# Altium project Grounded clock.PrjPcb (part 2 of 2)

## Sheet Power supply.SchDoc
size A; DrawnBy: James WIlson; Revision: B
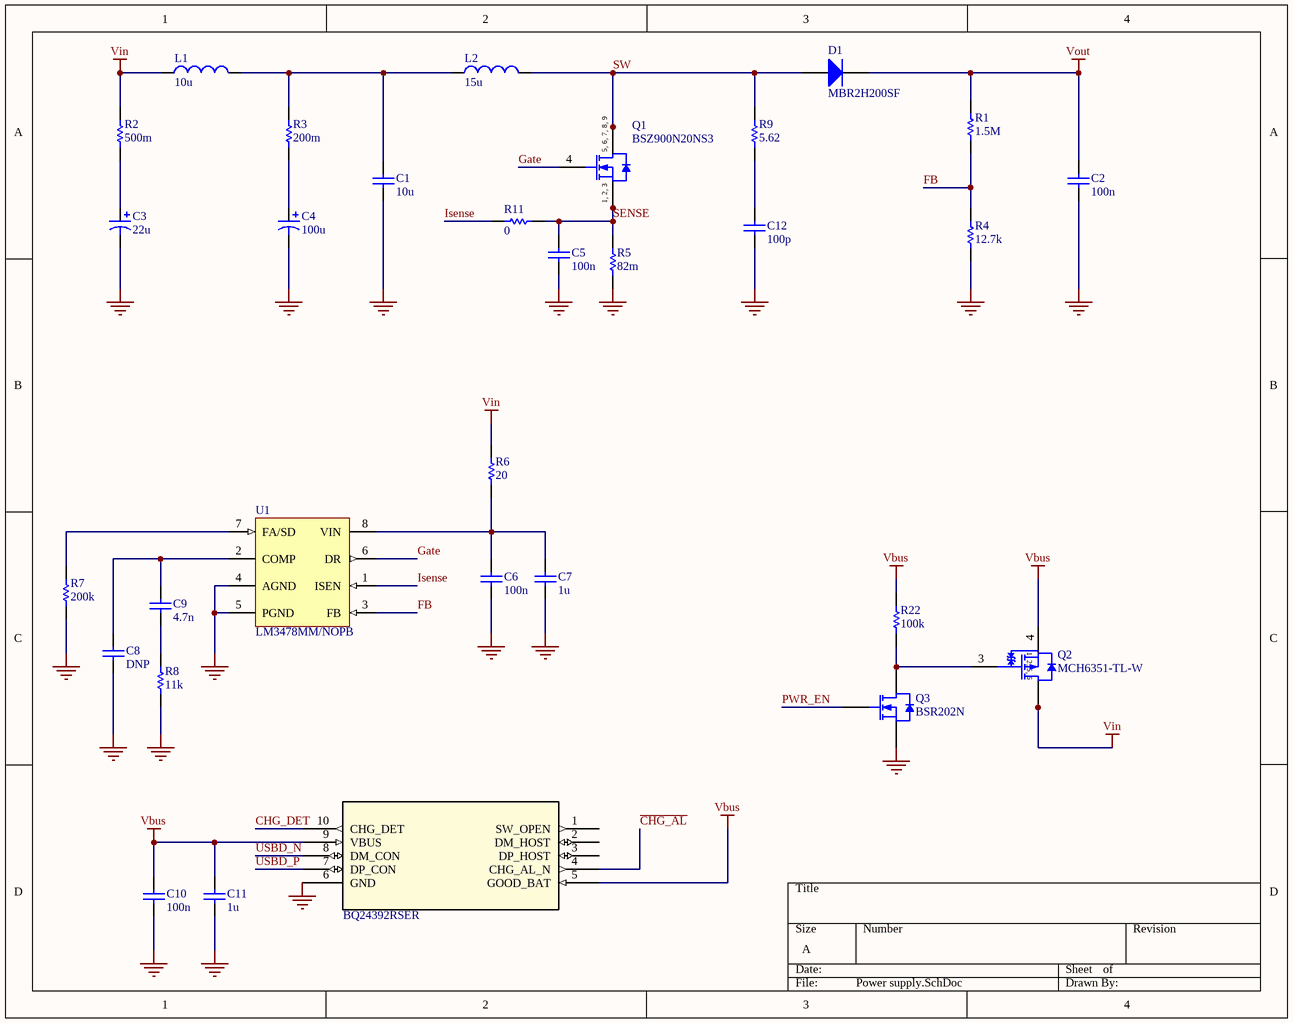
[diagram p3: Power supply.SchDoc]

### Parts
C1  10u  [CAPC1206(3216)190_N]
C2  100n  [CAPC1812(4532)230_N]
C3  22u  [KEMET A]
C4  100u  [KEMET A]
C5  100n  [CAPC0603(1608)100_N]
C6  100n  [CAPC0402(1005)33_N]
C7  1u  [CAPC0402(1005)33_N]
C8  DNP  [CAPC0603(1608)100_N]  (no BOM)
C9  4.7n  [CAPC0603(1608)100_N]
C10  100n  [CAPC0402(1005)33_N]
C11  1u  [CAPC0402(1005)33_N]
C12  100p  [CAPC0603(1608)100_N]
D1  MBR2H200SF  [SOD-123FL]
L1  10u  [VLS6045EX]
L2  15u  [SRU8043]
Q1  BSZ900N20NS3  [PG-TSDSON-8]
Q2  MCH6351-TL-W  [SOT23-6P65_210X90L25X32]
Q3  BSR202N  [INF-PG-SC59_N]
R1  1.5M  [RESC0805(2012)_N]
R2  500m  [RESC0402(1005)_N]
R3  200m  [RESC0402(1005)_N]
R4  12.7k  [RESC0805(2012)_N]
R5  82m  [RESC0603(1608)_N]
R6  20  [RESC0402(1005)_N]
R7  200k  [RESC0402(1005)_N]
R8  11k  [RESC0402(1005)_N]
R9  5.62  [RESC0603(1608)_N]
R11  0  [RESC0402(1005)_N]
R22  100k  [RESC0402(1005)_N]
U1  LM3478MM/NOPB  [DGK0008A_N]
U2  BQ24392RSER  [QFN50P200X150X60-10N]

### Nets
GND: C1.1 C2.1 C3.2 C4.2 C5.1 C6.1 C7.1 C8.1 C10.1 C11.1 C12.1 Q3.2(SOURCE) R4.1 R5.1 R7.1 R8.1 U1.4(AGND) U1.5(PGND) U2.6(GND)
Vbus: C10.2 C11.2 Q2.4(S) R22.2 U2.5(GOOD_BAT) U2.9(VBUS)
Vin: L1.1 Q2.1(D) Q2.2(D) Q2.5(D) Q2.6(D) R2.2 R6.2
Vout: C2.2 D1.2(K) R1.2
~{CHG_AL}: U2.4(CHG_AL_N)
CHG_DET: U2.10(CHG_DET)
FB: R1.1 R4.2 U1.3(FB)
Gate: Q1.4(GATE) U1.6(DR)
Isense: R11.1 U1.1(ISEN)
PWR_EN: Q3.1(GATE)
SENSE: C5.2 Q1.1(SOURCE) Q1.2(SOURCE) Q1.3(SOURCE) R5.2 R11.2
SW: D1.1(A) L2.2 Q1.5(DRAIN) Q1.6(DRAIN) Q1.7(DRAIN) Q1.8(DRAIN) Q1.9(DRAIN) R9.2
USBD_N: U2.8(DM_CON)
USBD_P: U2.7(DP_CON)
NetC1_2: C1.2 L1.2 L2.1 R3.2
NetC3_1: C3.1 R2.1
NetC4_1: C4.1 R3.1
NetC6_2: C6.2 C7.2 R6.1 U1.8(VIN)
NetC8_2: C8.2 C9.2 U1.2(COMP)
NetC9_1: C9.1 R8.2
NetC12_2: C12.2 R9.1
NetQ2_3: Q2.3(G) Q3.3(DRAIN) R22.1
NetR7_2: R7.2 U1.7(FA/SD)

Not connected (* = marked no-connect by the designer): U2 1(SW_OPEN) 2(DM_HOST) 3(DP_HOST)

### Notes on the sheet
- (in symbol BSZ900N20NS3GATMA1) 5, 6, 7, 8, 9; 1, 2, 3
- (in symbol MCH6351-TL-W) 1, 2, 5, 6

### Library data of the parts
C1 = C3216X7R1E106K160AB: CAP CER 10UF 25V X7R 1206; Manufacturer: TDK Corporation; Tolerance: ±10%; Notification: Current market demand for these product types have resulted in fluctuating and extending lead times. Lead times may differ.; Supplier 1: Digi-Key; Manufacturer Part Number: C3216X7R1E106K160AB; RoHS: RoHS Compliant; Category: Capacitors; Stock 1: 20000; Pricing 1: 1=0.83, 10=0.589, 100=0.3881, 500=0.2875, 1000=0.24438 (USD); Packaging: Cut Tape (CT); Part Status: Active; Voltage - Rated: 25V; Temperature Coefficient: X7R; Operating Temperature: -55°C ~ 125°C; Features: Low ESL; Ratings: -; Applications: General Purpose; Failure Rate: -; Mounting Type: Surface Mount, MLCC; Package / Case: 1206 (3216 Metric); Size / Dimension: 0.126" L x 0.063" W (3.20mm x 1.60mm); Height - Seated (Max): -; Thickness (Max): 0.075" (1.90mm); Lead Spacing: -; Lead Style: -; ComponentLink1URL: https://product.tdk.com/info/en/catalog/datasheets/mlcc_commercial_general_en.pdf; ComponentLink1Description: https://product.tdk.com/info/en/catalog/datasheets/mlcc_commercial_general_en.pdf; Supplier Part Number 1: 445-7705-1-ND; Supplier 2: Mouser; Supplier Part Number 2: 810-C3216X7R1E106K
C2 = C1812C104J2GACAUTO: KEMET         C1812C104J2GACAUTO            SMD Multilayer Ceramic Capacitor, AEC-Q200 C Series, 0.1 F,  5%, C0G / NP0, 200 V; Capacitance: 100nF; Voltage Rating: 200V; Temperature Coefficient: 30ppm/°C; Supplier 1: Digi-Key; Manufacturer: KEMET; Manufacturer Part Number: C1812C104J2GACAUTO; Stock 1: 5000; Pricing 1: 1=2.08, 10=1.679, 100=1.2824 (USD); Mount: Surface Mount; Case/Package: 1812; Weight: 0.000952oz; Case Code (Metric): 4532; Case Code (Imperial): 1812; Dielectric Material: Ceramic; Min Operating Temperature: -55°C; Max Operating Temperature: 125°C; Tolerance: 5%; Packaging: Tape and Reel; Dielectric: C0G; Voltage: 200V; Termination: SMD/SMT; Voltage Rating (DC): 200V; Package Quantity: 500; Length: 4.5mm; Height: 2mm; Width: 3.2mm; Thickness: 0.087inch; Depth: 3.2mm; Ratings: AEC-Q200; REACH SVHC: No SVHC; Lead Free: Lead Free; ComponentLink1URL: http://www.farnell.com/datasheets/1929048.pdf; ComponentLink1Description: http://www.farnell.com/datasheets/1929048.pdf; Supplier Part Number 1: 399-11585-1-ND
C3 = T520A226M006ATE100: CAP TANT POLY 22UF 6.3V 1206; Supplier 1: Digi-Key; Supplier 2: Mouser; Supplier Part Number 1: 399-5271-1-ND; Supplier Part Number 2: 80-T520A226M6ATE100
C4 = T520A107M006ATE045: POLY TA SMD 3216 100UF 6.3V 20%; Supplier 1: Digi-Key; Supplier 2: Mouser; Supplier Part Number 1: 399-18160-1-ND; Supplier Part Number 2: 80-T520A107M06ATE045
C5 = C0603C104K8RACTU: CAP CER 0.1UF 10V X7R 0603; Manufacturer: KEMET; Dielectric Material: Ceramic; Capacitance: 100nF; Tolerance: 10%; Dissipation Factor: 5%; Supplier 1: Digi-Key; Manufacturer Part Number: C0603C104K8RACTU; Stock 1: 40000; Pricing 1: 1=0.16, 10=0.112, 100=0.0525, 500=0.03682, 1000=0.03049 (USD); Mount: PCB,Surface Mount; Case/Package: 0603; Number of Pins: 2; Case Code (Imperial): 0603; Case Code (Metric): 1608; Contact Plating: Matte,Tin; Min Operating Temperature: -55°C; Max Operating Temperature: 125°C; Voltage Rating: 10V; Packaging: Tape and Reel; Package Quantity: 1; Voltage Rating (DC): 10V; Dielectric: X7R; Termination: SMD/SMT; Voltage: 10V; Length: 1.6mm; Height: 0.8mm; Width: 0.8mm; Lead Pitch: 0.7mm; Thickness: 0.034inch; Depth: 0.8mm; Radiation Hardening: No; REACH SVHC: No SVHC; ComponentLink1URL: http://www.farnell.com/datasheets/2315110.pdf; ComponentLink1Description: http://www.farnell.com/datasheets/2315110.pdf; ComponentLink2URL: http://www.kemet.com/kemet/web/homepage/kechome.nsf/vapubfiles/KEM_C1002_X7R_SMD.pdf/$file/KEM_C1002_X7R_SMD.pdf; ComponentLink2Description: http://www.kemet.com/kemet/web/homepage/kechome.nsf/vapubfiles/KEM_C1002_X7R_SMD.pdf/$file/KEM_C1002_X7R_SMD.pdf; ComponentLink3URL: https://www.verical.com/server-webapp/html/getDatasheet?partID=91529; ComponentLink3Description: https://www.verical.com/server-webapp/html/getDatasheet?partID=91529; ComponentLink4URL: http://www.mouser.com/ds/2/212/KEM_C1002_X7R_SMD-1102033.pdf; ComponentLink4Description: http://www.mouser.com/ds/2/212/KEM_C1002_X7R_SMD-1102033.pdf; ComponentLink5URL: http://www.alliedelec.com/m/d/9bfe7773041ffe9d406e68bc7b377fdd.pdf; ComponentLink5Description: http://www.alliedelec.com/m/d/9bfe7773041ffe9d406e68bc7b377fdd.pdf; ComponentLink6URL: http://www.farnell.com/datasheets/1851736.pdf; ComponentLink6Description: http://www.farnell.com/datasheets/1851736.pdf; Supplier Part Number 1: 399-1095-1-ND
C6 C10 = CC0402KRX7R8BB104: CAP CER 0.1UF 25V X7R 0402; Manufacturer: Yageo; Tolerance: ±10%; Notification: Current market demand for these product types have resulted in fluctuating and extending lead times. Lead times may differ.; Supplier 1: Digi-Key; Manufacturer Part Number: CC0402KRX7R8BB104; RoHS: RoHS Compliant; Category: Capacitors; Stock 1: 0; Pricing 1: 1=0.1, 10=0.048, 100=0.0215, 500=0.01534, 1000=0.01205, 2500=0.01095, 5000=0.01007 (USD); Packaging: Cut Tape (CT); Part Status: Active; Voltage - Rated: 25V; Temperature Coefficient: X7R; Operating Temperature: -55°C ~ 125°C; Features: -; Ratings: -; Applications: General Purpose; Failure Rate: -; Mounting Type: Surface Mount, MLCC; Package / Case: 0402 (1005 Metric); Size / Dimension: 0.039" L x 0.020" W (1.00mm x 0.50mm); Height - Seated (Max): -; Thickness (Max): 0.022" (0.55mm); Lead Spacing: -; Lead Style: -; ComponentLink1URL: http://www.yageo.com/documents/recent/UPY-GPHC_X7R_6.3V-to-50V_18.pdf; ComponentLink1Description: http://www.yageo.com/documents/recent/UPY-GPHC_X7R_6.3V-to-50V_18.pdf; Supplier Part Number 1: 311-2077-1-ND; Supplier 2: Mouser; Supplier Part Number 2: 603-CC402KRX7R8BB104
C7 C11 = CGB2A1X5R1E105K033BC: CAP CER 1UF 25V X5R 0402; Supplier 1: Digi-Key; Supplier 2: Mouser; Supplier Part Number 1: 445-13185-1-ND; Supplier Part Number 2: 810-CGB2A1X5R1E105BC
C8 = 0402 DNP JUMPER
C9 = C1608C0G1H472J080AA: CAP CER 4700PF 50V C0G 0603; Supplier 1: Digi-Key; Supplier 2: Mouser; Supplier Part Number 1: 445-7400-1-ND; Supplier Part Number 2: 810-C1608C0G1H472J
C12 = C0603C101JAGACTU: CAP CER 100PF 250V C0G/NP0 0603; Manufacturer: KEMET; Dielectric Material: Ceramic; Tolerance: 5%; Supplier 1: Digi-Key; Manufacturer Part Number: C0603C101JAGACTU; Stock 1: 7181; Pricing 1: 1=0.56, 10=0.397, 100=0.2612, 500=0.1935, 1000=0.16448 (USD); Case/Package: 0603; Voltage Rating (DC): 250V; Capacitance: 100pF; Lead Free: Lead Free; Supplier 2: Mouser; Stock 2: 0; Pricing 2: 1=0.54, 10=0.313, 50=0.313, 100=0.189, 1000=0.155, 10000=0.135 (USD); Supplier Part Number 1: 399-14933-1-ND; Supplier Part Number 2: 80-C0603C101JAG
D1 = MBR2H200SF: DIODE SCHOTTKY 200V 2A SOD123; pin to pad: 1>A 2>K; Manufacturer: ON Semiconductor; Manufacturer Part Number: MBR2H200SFT3G; Supplier 1: Digi-Key; Supplier Part Number 1: MBR2H200SFT3GOSCT-ND; Stock 1: 78470; Pricing 1: 1=0.44, 10=0.328, 100=0.1857, 500=0.12298, 1000=0.09428 (USD); Mount: Surface Mount; Packaging: Tape and Reel; Average Rectified Current: 2A; Max Reverse Voltage (DC): 200V; Lead Free: Lead Free
L1 = VLS6045EX-100M: FIXED IND 10UH 3.4A 61 MOHM SMD; Supplier 1: Digi-Key; Supplier 2: Mouser; Supplier Part Number 1: 445-173039-1-ND; Supplier Part Number 2: 810-VLS6045EX-100M
L2 = SRU8043-150Y: FIXED IND 15UH 2.7A 46 MOHM SMD; Manufacturer: Bourns; Core Material: Ferrite; Tolerance: 30%; DC Resistance (DCR): 46mR; Saturation Current: 2A; Shielding: Shielded; Q Factor: 26; Self Resonant Frequency: 15MHz; Test Frequency: 100kHz; Supplier 1: Digi-Key; Manufacturer Part Number: SRU8043-150Y; Stock 1: 6452; Pricing 1: 1=0.97, 10=0.897, 100=0.6486, 500=0.4968 (USD); Mount: Surface Mount; Case/Package: Nonstandard; Min Operating Temperature: -40°C; Max Operating Temperature: 125°C; Inductance: 15uh; Max DC Current: 2.7A; Package Quantity: 1000; Current Rating: 2.7A; Packaging: Tape and Reel; Inductance Tolerance: 30%; Composition: Wirewound; Termination: SMD/SMT; RMS Current (Irms): 2.7A; DC Current: 2.7A; Military Standard: Not; Length: 8mm; Height: 4.3mm; Width: 0.315inch; Height - Seated (Max): 0.181inch; Depth: 8.3mm; REACH SVHC: No SVHC; ComponentLink1URL: http://www.bourns.com/docs/Product-Datasheets/SRU8043.pdf; ComponentLink1Description: http://www.bourns.com/docs/Product-Datasheets/SRU8043.pdf; ComponentLink2URL: http://www.farnell.com/datasheets/70887.pdf; ComponentLink2Description: http://www.farnell.com/datasheets/70887.pdf; ComponentLink3URL: http://www.mouser.com/ds/2/54/RU8043-778433.pdf; ComponentLink3Description: http://www.mouser.com/ds/2/54/RU8043-778433.pdf; ComponentLink4URL: http://www.farnell.com/datasheets/1776933.pdf; ComponentLink4Description: http://www.farnell.com/datasheets/1776933.pdf; ComponentLink5URL: http://uk.rs-online.com/webdocs/0dd1/0900766b80dd1166.pdf; ComponentLink5Description: http://uk.rs-online.com/webdocs/0dd1/0900766b80dd1166.pdf; ComponentLink6URL: http://www.bourns.com/pdfs/SRU8043.pdf; ComponentLink6Description: http://www.bourns.com/pdfs/SRU8043.pdf; Supplier Part Number 1: SRU8043-150YCT-ND
Q1 = BSZ900N20NS3GATMA1: Trans MOSFET N-CH 200V 15.2A 8-Pin TSDSON; Manufacturer: Infineon; Gate to Source Voltage (Vgs): 20V; Rise Time: 4ns; Turn-On Delay Time: 5ns; Turn-Off Delay Time: 10ns; Fall Time: 3ns; Power Dissipation: 62.5W; Number of Elements: 1; Supplier 1: Digi-Key; Manufacturer Part Number: BSZ900N20NS3GATMA1; Stock 1: 334; Pricing 1: 1=1.84, 10=1.665, 100=1.3378, 500=1.04054, 1000=0.86216 (USD); Mount: Surface Mount; Number of Pins: 8; Contact Plating: Tin; Min Operating Temperature: -55°C; Max Operating Temperature: 150°C; Continuous Drain Current (ID): 15.2A; Drain to Source Voltage (Vdss): 200V; Max Dual Supply Voltage: 200V; Lead Free: Contains Lead; Halogen Free: Halogen Free; ComponentLink1URL: http://www.infineon.com/dgdl/BSZ900N20NS3+Rev2.2.pdf?folderId=db3a304325305e6d012596c6ca7b290a&fileId=db3a30432ad629a6012b15f1be561a9b; ComponentLink1Description: http://www.infineon.com/dgdl/BSZ900N20NS3+Rev2.2.pdf?folderId=db3a304325305e6d012596c6ca7b290a&fileId=db3a30432ad629a6012b15f1be561a9b; Supplier Part Number 1: BSZ900N20NS3GATMA1CT-ND
Q2 = MCH6351-TL-W: MOSFET PCH 1.8V DRIVE SERIES; Manufacturer: ON Semiconductor; Rise Time: 89ns; Drain to Source Voltage (Vdss): 12V; Continuous Drain Current (ID): 9A; Rds On Max: 16.9mR; Input Capacitance: 2.2nF; Max Power Dissipation: 1.5W; Number of Channels: 1; Turn-On Delay Time: 12.3ns; Turn-Off Delay Time: 260ns; Fall Time: 122ns; Drain to Source Breakdown Voltage: -12V; Gate to Source Voltage (Vgs): 10V; Element Configuration: Single; ComponentLink2Description: http://www.mouser.com/ds/2/308/ENA2198-D-278502.pdf; ComponentLink1Description: http://www.onsemi.com/pub_link/Collateral/ENA2198-D.PDF; ComponentLink1URL: http://www.onsemi.com/pub_link/Collateral/ENA2198-D.PDF; ComponentLink2URL: http://www.mouser.com/ds/2/308/ENA2198-D-278502.pdf; Supplier 1: Digi-Key; Supplier Part Number 1: MCH6351-TL-WOSCT-ND; Manufacturer Part Number: MCH6351-TL-W; Stock 1: 2960; Pricing 1: 1=0.59, 10=0.499, 100=0.3739, 500=0.27418, 1000=0.21187 (USD); Case/Package: SMD/SMT; Number of Pins: 6; Weight: 0.000265oz; Min Operating Temperature: -55°C; Max Operating Temperature: 150°C; Package Quantity: 3000; Packaging: Tape and Reel; Drain to Source Resistance: 16.9mR; Radiation Hardening: No; Lead Free: Lead Free; Halogen Free: Halogen Free
Q3 = BSR202N: Trans MOSFET N-CH 20V 3.8A 3-Pin SC-59 T/R; Manufacturer: Infineon; Manufacturer Part Number: BSR202NL6327HTSA1; Gate to Source Voltage (Vgs): 12V; Rise Time: 16.7ns; Supplier 1: Digi-Key; Stock 1: 17256; Pricing 1: 1=0.54, 10=0.455, 100=0.3416, 500=0.25052, 1000=0.19358 (USD); Mount: Surface Mount; Case/Package: SC; Number of Pins: 3; Contact Plating: Tin; Min Operating Temperature: -55°C; Max Operating Temperature: 150°C; Continuous Drain Current (ID): 3.8A; Drain to Source Voltage (Vdss): 20V; Max Dual Supply Voltage: 20V; ComponentLink1URL: http://www.infineon.com/dgdl/BSR202N_Rev1.05.pdf?folderId=db3a3043156fd573011622e10b5c1f67&fileId=db3a3043156fd573011622e5576e1f72; ComponentLink1Description: http://www.infineon.com/dgdl/BSR202N_Rev1.05.pdf?folderId=db3a3043156fd573011622e10b5c1f67&fileId=db3a3043156fd573011622e5576e1f72; Supplier Part Number 1: BSR202NL6327HTSA1CT-ND
R1 = CPF0805B1M5E1: RES SMD 1.5M OHM 0.1% 1/10W 0805; Manufacturer: TE Connectivity Passive Product; Power (Watts): 0.1W, 1/10W; Temperature Coefficient: ±25ppm/°C; Supplier 1: Digi-Key; Manufacturer Part Number: CPF0805B1M5E1; RoHS: RoHS Compliant; Category: Resistors; Stock 1: 27374; Pricing 1: 1=0.55, 10=0.394, 100=0.2047 (USD); Packaging: Cut Tape (CT); Part Status: Active; Tolerance: ±0.1%; Composition: Thin Film; Features: -; Operating Temperature: -55°C ~ 155°C; Package / Case: 0805 (2012 Metric); Supplier Device Package: 0805; Size / Dimension: 0.079" L x 0.049" W (2.00mm x 1.25mm); Height - Seated (Max): 0.026" (0.65mm); Failure Rate: -; ComponentLink1URL: http://www.te.com/commerce/DocumentDelivery/DDEController?Action=srchrtrv&DocNm=1773200&DocType=DS&DocLang=English; ComponentLink1Description: http://www.te.com/commerce/DocumentDelivery/DDEController?Action=srchrtrv&DocNm=1773200&DocType=DS&DocLang=English; Supplier Part Number 1: A103799CT-ND; Supplier 2: Mouser; Supplier Part Number 2: 279-CPF0805B1M5E1
R2 = RL0402FR-070R5L: RES 0.5 OHM 1% 1/16W 0402; Manufacturer: Yageo; Manufacturer Part Number: RC0402FR-071RL; Power (Watts): 0.063W, 1/16W; Temperature Coefficient: ±200ppm/°C; RoHS: RoHS Compliant; Category: Resistors; Packaging: Cut Tape (CT); Part Status: Active; Tolerance: ±1%; Composition: Thick Film; Features: Moisture Resistant; Operating Temperature: -55°C ~ 155°C; Package / Case: 0402 (1005 Metric); Supplier Device Package: 0402; Size / Dimension: 0.039" L x 0.020" W (1.00mm x 0.50mm); Height - Seated (Max): 0.016" (0.40mm); Failure Rate: -; ComponentLink1URL: http://www.yageo.com/documents/recent/PYu-RC_Group_51_RoHS_L_9.pdf; ComponentLink1Description: http://www.yageo.com/documents/recent/PYu-RC_Group_51_RoHS_L_9.pdf; Supplier 1: Digi-Key; Supplier 2: Mouser; Supplier Part Number 1: 311-.5PCT-ND; Supplier Part Number 2: 603-RL0402FR070R5L
R3 = RL0402FR-070R22L: RES 0.22 OHM 1% 1/16W 0402; Manufacturer: Yageo; Manufacturer Part Number: RC0402FR-071RL; Power (Watts): 0.063W, 1/16W; Temperature Coefficient: ±200ppm/°C; RoHS: RoHS Compliant; Category: Resistors; Packaging: Cut Tape (CT); Part Status: Active; Tolerance: ±1%; Composition: Thick Film; Features: Moisture Resistant; Operating Temperature: -55°C ~ 155°C; Package / Case: 0402 (1005 Metric); Supplier Device Package: 0402; Size / Dimension: 0.039" L x 0.020" W (1.00mm x 0.50mm); Height - Seated (Max): 0.016" (0.40mm); Failure Rate: -; ComponentLink1URL: http://www.yageo.com/documents/recent/PYu-RC_Group_51_RoHS_L_9.pdf; ComponentLink1Description: http://www.yageo.com/documents/recent/PYu-RC_Group_51_RoHS_L_9.pdf; Supplier 1: Digi-Key; Supplier 2: Mouser; Supplier Part Number 1: 311-.22PCT-ND; Supplier Part Number 2: 603-RL0402FR-070R22L
R4 = RT0805BRD0712K7L: RES SMD 12.7K OHM 0.1% 1/8W 0805; Manufacturer: Yageo; Power (Watts): 0.125W, 1/8W; Temperature Coefficient: ±25ppm/°C; Supplier 1: Digi-Key; Manufacturer Part Number: RT0805BRD0712K7L; RoHS: RoHS Compliant; Category: Resistors; Stock 1: 19760; Pricing 1: 1=0.4, 10=0.285, 100=0.1139, 1000=0.05612, 2500=0.05199 (USD); Packaging: Cut Tape (CT); Part Status: Active; Tolerance: ±0.1%; Composition: Thin Film; Features: -; Operating Temperature: -55°C ~ 155°C; Package / Case: 0805 (2012 Metric); Supplier Device Package: 0805; Size / Dimension: 0.079" L x 0.049" W (2.00mm x 1.25mm); Height - Seated (Max): 0.024" (0.60mm); Failure Rate: -; ComponentLink1URL: http://www.yageo.com/documents/recent/PYu-RT_1-to-0.01_RoHS_L_9.pdf; ComponentLink1Description: http://www.yageo.com/documents/recent/PYu-RT_1-to-0.01_RoHS_L_9.pdf; Supplier Part Number 1: YAG1775CT-ND; Supplier 2: Mouser; Supplier Part Number 2: 603-RT0805BRD0712K7L
R5 = ERJ-3BWFR082V: PANASONIC ELECTRONIC COMPONENTS         ERJ3BWFR082V             SMD Current Sense Resistor, 0.082 ohm, 0603 [1608 Metric], 250 mW,  1%; Resistance: 82mR; Power Rating: 250mW; Temperature Coefficient: 150ppm/°C; Max Power Dissipation: 333mW; Supplier 1: Digi-Key; Manufacturer: Panasonic; Manufacturer Part Number: ERJ-3BWFR082V; Stock 1: 6353; Pricing 1: 1=0.41, 10=0.312, 100=0.1311, 1000=0.07232, 2500=0.0678 (USD); Mount: Surface Mount; Case/Package: 0603; Number of Pins: 2; Case Code (Imperial): 0603; Case Code (Metric): 1608; Min Operating Temperature: -55°C; Max Operating Temperature: 155°C; Tolerance: 1%; Packaging: Tape and Reel; Package Quantity: 5000; Composition: Low-Ohm-Resistor,Thick Film; Number of Terminations: 2; Termination: SMD/SMT; Military Standard: Not; Features: Automotive AEC-Q200; Length: 1.6mm; Height: 0.022inch; Width: 0.031inch; Depth: 0.8mm; Radiation Hardening: No; REACH SVHC: Unknown; ComponentLink1URL: http://uk.rs-online.com/webdocs/1107/0900766b81107548.pdf; ComponentLink1Description: http://uk.rs-online.com/webdocs/1107/0900766b81107548.pdf; ComponentLink2URL: http://www.farnell.com/datasheets/1662788.pdf; ComponentLink2Description: http://www.farnell.com/datasheets/1662788.pdf; ComponentLink3URL: https://www.distrelec.biz/Web/Downloads/_t/ds/ERJ_eng_tds.pdf?mime=application%2Fpdf; ComponentLink3Description: https://www.distrelec.biz/Web/Downloads/_t/ds/ERJ_eng_tds.pdf?mime=application%2Fpdf; ComponentLink4URL: http://industrial.panasonic.com/www-data/pdf/AOA0000/AOA0000CE3.pdf; ComponentLink4Description: http://industrial.panasonic.com/www-data/pdf/AOA0000/AOA0000CE3.pdf; ComponentLink5URL: http://www.farnell.com/datasheets/1790602.pdf; ComponentLink5Description: http://www.farnell.com/datasheets/1790602.pdf; Supplier Part Number 1: P17476CT-ND
R6 = RC0402FR-0720RL: RES SMD 20 OHM 1% 1/16W 0402; Manufacturer: Yageo; Power (Watts): 0.063W, 1/16W; Temperature Coefficient: ±100ppm/°C; Supplier 1: Digi-Key; Manufacturer Part Number: RC0402FR-0720RL; RoHS: RoHS Compliant; Category: Resistors; Stock 1: 512120; Pricing 1: 1=0.1, 10=0.021, 100=0.0083, 1000=0.00375, 2500=0.00325, 5000=0.00269 (USD); Packaging: Cut Tape (CT); Part Status: Active; Tolerance: ±1%; Composition: Thick Film; Features: Moisture Resistant; Operating Temperature: -55°C ~ 155°C; Package / Case: 0402 (1005 Metric); Supplier Device Package: 0402; Size / Dimension: 0.039" L x 0.020" W (1.00mm x 0.50mm); Height - Seated (Max): 0.016" (0.40mm); Failure Rate: -; ComponentLink1URL: http://www.yageo.com/documents/recent/PYu-RC_Group_51_RoHS_L_9.pdf; ComponentLink1Description: http://www.yageo.com/documents/recent/PYu-RC_Group_51_RoHS_L_9.pdf; Supplier Part Number 1: 311-20LRCT-ND; Supplier 2: Mouser; Supplier Part Number 2: 603-RC0402FR-0720RL
R7 = RC0402FR-07200KL: RES SMD 200K OHM 1% 1/16W 0402; Manufacturer: Yageo; Power (Watts): 0.063W, 1/16W; Temperature Coefficient: ±100ppm/°C; Supplier 1: Digi-Key; Manufacturer Part Number: RC0402FR-07200KL; RoHS: RoHS Compliant; Category: Resistors; Stock 1: 7816895; Pricing 1: 1=0.1, 10=0.018, 100=0.0076, 1000=0.00356, 2500=0.00313, 5000=0.00263 (USD); Packaging: Cut Tape (CT); Part Status: Active; Tolerance: ±1%; Composition: Thick Film; Features: Moisture Resistant; Operating Temperature: -55°C ~ 155°C; Package / Case: 0402 (1005 Metric); Supplier Device Package: 0402; Size / Dimension: 0.039" L x 0.020" W (1.00mm x 0.50mm); Height - Seated (Max): 0.016" (0.40mm); Failure Rate: -; ComponentLink1URL: http://www.yageo.com/documents/recent/PYu-RC_Group_51_RoHS_L_9.pdf; ComponentLink1Description: http://www.yageo.com/documents/recent/PYu-RC_Group_51_RoHS_L_9.pdf; Supplier Part Number 1: 311-200KLRCT-ND
R8 = RC0402FR-0711KL: RES SMD 11K OHM 1% 1/16W 0402; Manufacturer: Yageo; Power (Watts): 0.063W, 1/16W; Temperature Coefficient: ±100ppm/°C; Supplier 1: Digi-Key; Manufacturer Part Number: RC0402FR-0711KL; RoHS: RoHS Compliant; Category: Resistors; Stock 1: 10146; Pricing 1: 1=0.1, 10=0.021, 100=0.0083, 1000=0.00375, 2500=0.00325, 5000=0.00269 (USD); Packaging: Cut Tape (CT); Part Status: Active; Tolerance: ±1%; Composition: Thick Film; Features: Moisture Resistant; Operating Temperature: -55°C ~ 155°C; Package / Case: 0402 (1005 Metric); Supplier Device Package: 0402; Size / Dimension: 0.039" L x 0.020" W (1.00mm x 0.50mm); Height - Seated (Max): 0.016" (0.40mm); Failure Rate: -; ComponentLink1URL: http://www.yageo.com/documents/recent/PYu-RC_Group_51_RoHS_L_9.pdf; ComponentLink1Description: http://www.yageo.com/documents/recent/PYu-RC_Group_51_RoHS_L_9.pdf; Supplier Part Number 1: 311-11.0KLRCT-ND; Supplier 2: Mouser; Supplier Part Number 2: 603-RC0402FR-0711KL
R9 = CRCW06035R62FKEA: RES SMD 5.62 OHM 1% 1/10W 0603; Manufacturer: Vishay Dale; Resistance: 5.62R; Power Rating: 100mW; Voltage Rating: 75V; Temperature Coefficient: 100ppm/°C; Supplier 1: Digi-Key; Manufacturer Part Number: CRCW06035R62FKEA; Stock 1: 1833; Pricing 1: 1=0.1, 10=0.046, 100=0.0187, 1000=0.0084, 2500=0.00729 (USD); Case/Package: 0603; Number of Pins: 2; Weight: 7.1E-05oz; Case Code (Metric): 1608; Case Code (Imperial): 0603; Contact Plating: Tin; Min Operating Temperature: -55°C; Max Operating Temperature: 155°C; Tolerance: 1%; Packaging: Tape and Reel; Package Quantity: 10; Composition: Thick Film; Number of Terminations: 2; Military Standard: Not; Max Power Dissipation: 100mW; Voltage Rating (DC): 75V; Features: Automotive AEC-Q200; Length: 1.55mm; Height: 0.02inch; Width: 0.033inch; Depth: 0.85mm; REACH SVHC: Unknown; Lead Free: Lead Free; ComponentLink1URL: http://www.vishay.com/docs/20035/dcrcwe3.pdf; ComponentLink1Description: http://www.vishay.com/docs/20035/dcrcwe3.pdf; Supplier Part Number 1: 541-5.62HHCT-ND; Supplier 2: Mouser; Stock 2: 70897; Pricing 2: 1=0.1, 10=0.044, 50=0.044, 100=0.026, 1000=0.018, 10000=0.006 (USD); Supplier Part Number 2: 71-CRCW0603-5.62-E3
R11 = RC0402FR-070RL: RES SMD 0 OHM JUMPER 1/16W 0402; Manufacturer: Yageo; Power (Watts): 0.063W, 1/16W; Supplier 1: Digi-Key; Manufacturer Part Number: RC0402FR-070RL; RoHS: RoHS Compliant; Category: Resistors; Stock 1: 0; Pricing 1: 1=0.1, 10=0.016, 25=0.0116, 50=0.0088, 100=0.0065, 250=0.00496, 500=0.00396, 1000=0.00292, 5000=0.00209 (USD); Packaging: Cut Tape (CT); Part Status: Active; Tolerance: Jumper; Composition: Thick Film; Features: Moisture Resistant; Temperature Coefficient: -; Operating Temperature: -55°C ~ 155°C; Package / Case: 0402 (1005 Metric); Supplier Device Package: 0402; Size / Dimension: 0.039" L x 0.020" W (1.00mm x 0.50mm); Height - Seated (Max): 0.016" (0.40mm); Failure Rate: -; ComponentLink1URL: http://www.yageo.com/documents/recent/PYu-RC_Group_51_RoHS_L_9.pdf; ComponentLink1Description: http://www.yageo.com/documents/recent/PYu-RC_Group_51_RoHS_L_9.pdf; Supplier Part Number 1: 311-0.0LRCT-ND; Supplier 2: Mouser; Supplier Part Number 2: 603-RC0402FR-070RL
R22 = RC0402FR-07100KL: RES SMD 100K OHM 1% 1/16W 0402; Manufacturer: Yageo; Power (Watts): 0.063W, 1/16W; Temperature Coefficient: ±100ppm/°C; Supplier 1: Digi-Key; Manufacturer Part Number: RC0402FR-07100KL; RoHS: RoHS Compliant; Category: Resistors; Stock 1: 20396473; Pricing 1: 1=0.1, 10=0.018, 100=0.0076, 1000=0.00356, 2500=0.00313, 5000=0.00263 (USD); Packaging: Cut Tape (CT); Part Status: Active; Tolerance: ±1%; Composition: Thick Film; Features: Moisture Resistant; Operating Temperature: -55°C ~ 155°C; Package / Case: 0402 (1005 Metric); Supplier Device Package: 0402; Size / Dimension: 0.039" L x 0.020" W (1.00mm x 0.50mm); Height - Seated (Max): 0.016" (0.40mm); Failure Rate: -; ComponentLink1URL: http://www.yageo.com/documents/recent/PYu-RC_Group_51_RoHS_L_9.pdf; ComponentLink1Description: http://www.yageo.com/documents/recent/PYu-RC_Group_51_RoHS_L_9.pdf; Supplier Part Number 1: 311-100KLRCT-ND
U1 = LM3478MM/NOPB: TEXAS INSTRUMENTS   LM3478MM/NOPB.   N-CHANNEL CONTROLLER, MSOP-8, FULL REEL; Output Voltage: 1.26V; Output Current: 1A; Switching Frequency: 1MHz; Number of Outputs: 1; Max Duty Cycle: 100%; Quiescent Current: 2.7mA; Frequency: 400kHz; Min Supply Voltage: 2.97V; Max Supply Voltage: 40V; Max Output Current: 2A; Topology: Boost,Flyback; Max Output Voltage: 5V; Output Type: Adjustable; ComponentLink1Description: https://www.verical.com/server-webapp/html/getDatasheet?partID=123464; Manufacturer: Texas Instruments; ComponentLink1URL: https://www.verical.com/server-webapp/html/getDatasheet?partID=123464; Supplier 1: Digi-Key; Supplier Part Number 1: LM3478MM/NOPBCT-ND; Supplier 2: Mouser; Supplier Part Number 2: 926-LM3478MM/NOPB; Manufacturer Part Number: LM3478MM/NOPB; Stock 1: 61350; Pricing 1: 1=2.21, 10=1.982, 100=1.5928, 500=1.30862 (USD); Mount: Surface Mount; Case/Package: MSOP; Number of Pins: 8; Contact Plating: Matte,Tin; Min Operating Temperature: -40°C; Max Operating Temperature: 125°C; Packaging: Tape and Reel; Package Quantity: 1000; Max Frequency: 1MHz; Duty Cycle: 100%; Max Input Voltage: 40V; Min Input Voltage: 2.97V; Termination: SMD/SMT; Length: 3mm; Height: 0.86mm; Width: 3mm; Radiation Hardening: No; Lead Free: Lead Free; REACH SVHC: No SVHC; ComponentLink2URL: http://www.ti.com/general/docs/lit/getliterature.tsp?genericPartNumber=LM3478&fileType=pdf; ComponentLink2Description: http://www.ti.com/general/docs/lit/getliterature.tsp?genericPartNumber=LM3478&fileType=pdf; ComponentLink3URL: http://www.ti.com/lit/ds/symlink/lm3478.pdf; ComponentLink3Description: http://www.ti.com/lit/ds/symlink/lm3478.pdf; ComponentLink4URL: https://www.distrelec.com/ishop/Datasheets/lm3478_eng_tds.pdf; ComponentLink4Description: https://www.distrelec.com/ishop/Datasheets/lm3478_eng_tds.pdf
U2 = BQ24392RSER: SPST USB 2.0 High-Speed Switch With Battery Charging Detection; Vendor: Texas Instruments; Built_By: EMA_UL_Team; C: Copyright (C) 2016 Accelerated Designs. All rights reserved; Manufacturer_Part_Number: BQ24392RSER; Value: Value; Type: Type; RefDes: RefDes; Supplier 1: Digi-Key; Supplier Part Number 1: 296-37689-1-ND; Supplier 2: Mouser; Supplier Part Number 2: 595-BQ24392RSER

## Nets that join several sheets
3V3: MCU (C19.2 R23.2 U4.17 U6.5), Board connectors (J3.2 J4.1)
GND: Driver (6 pins), MCU (25 pins), Board connectors (6 pins), Power supply (19 pins)
Vbus: Driver (U3.8), MCU (C17.2 U5.8), Board connectors (J1.1), Power supply (6 pins)
Vout: Board connectors (J2.1 TP3.1), Power supply (C2.2 D1.2 R1.2)
~{CHG_AL}: MCU (U4.20), Power supply (U2.4)
CHG_DET: MCU (D2.1), Power supply (U2.10)
Nixie Aux: Driver (R19.2), Board connectors (J2.3)
Nixie Ind: Driver (R12.2), Board connectors (J2.2)
PWR_EN: MCU (U4.35), Power supply (Q3.1)
~{RESET}: MCU (U4.39), Board connectors (J4.10)
SENSE: Board connectors (TP2.1), Power supply (6 pins)
SetButton: MCU (U4.22), Board connectors (J3.3)
SetLED: MCU (R10.1), Board connectors (J3.1)
SW: Board connectors (TP1.1), Power supply (8 pins)
SWDCLK: MCU (U4.43), Board connectors (J4.4)
SWDIO: MCU (U4.44), Board connectors (J4.2)
SWO: MCU (U4.36), Board connectors (J4.6)
TimePWM3V3: Driver (R14.1), MCU (U4.33)
USBD_N: Board connectors (J1.2), Power supply (U2.8)
USBD_P: Board connectors (J1.3), Power supply (U2.7)

## Assembly variants
Only placed components + no slope comp: not fitted C5 C8